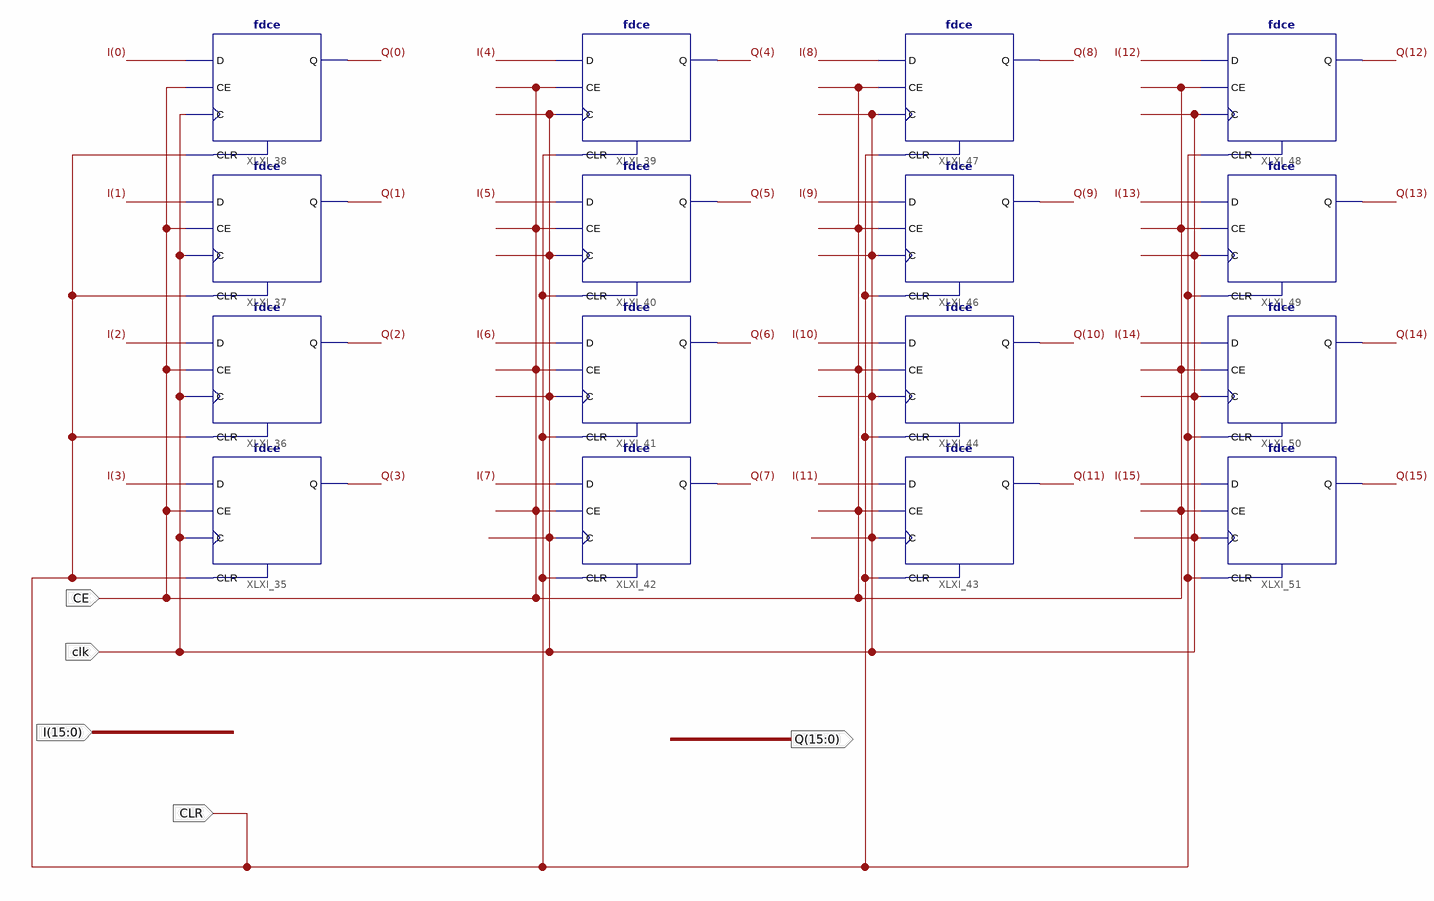
[diagram p0: schematic sheet 1]
// Xilinx ISE schematic reg_16b.sch (artix7) as structural Verilog: 16 symbols, 5 ports
module reg_16b (
  input  CE,
  input  clk,
  input  [15:0] I,
  input  CLR,
  output [15:0] Q
);

  fdce XLXI_35 (.C(clk), .CE(CE), .CLR(CLR), .D(I[3]), .Q(Q[3]));
  fdce XLXI_36 (.C(clk), .CE(CE), .CLR(CLR), .D(I[2]), .Q(Q[2]));
  fdce XLXI_37 (.C(clk), .CE(CE), .CLR(CLR), .D(I[1]), .Q(Q[1]));
  fdce XLXI_38 (.C(clk), .CE(CE), .CLR(CLR), .D(I[0]), .Q(Q[0]));
  fdce XLXI_39 (.C(clk), .CE(CE), .CLR(CLR), .D(I[4]), .Q(Q[4]));
  fdce XLXI_40 (.C(clk), .CE(CE), .CLR(CLR), .D(I[5]), .Q(Q[5]));
  fdce XLXI_41 (.C(clk), .CE(CE), .CLR(CLR), .D(I[6]), .Q(Q[6]));
  fdce XLXI_42 (.C(clk), .CE(CE), .CLR(CLR), .D(I[7]), .Q(Q[7]));
  fdce XLXI_43 (.C(clk), .CE(CE), .CLR(CLR), .D(I[11]), .Q(Q[11]));
  fdce XLXI_44 (.C(clk), .CE(CE), .CLR(CLR), .D(I[10]), .Q(Q[10]));
  fdce XLXI_46 (.C(clk), .CE(CE), .CLR(CLR), .D(I[9]), .Q(Q[9]));
  fdce XLXI_47 (.C(clk), .CE(CE), .CLR(CLR), .D(I[8]), .Q(Q[8]));
  fdce XLXI_48 (.C(clk), .CE(CE), .CLR(CLR), .D(I[12]), .Q(Q[12]));
  fdce XLXI_49 (.C(clk), .CE(CE), .CLR(CLR), .D(I[13]), .Q(Q[13]));
  fdce XLXI_50 (.C(clk), .CE(CE), .CLR(CLR), .D(I[14]), .Q(Q[14]));
  fdce XLXI_51 (.C(clk), .CE(CE), .CLR(CLR), .D(I[15]), .Q(Q[15]));
endmodule
